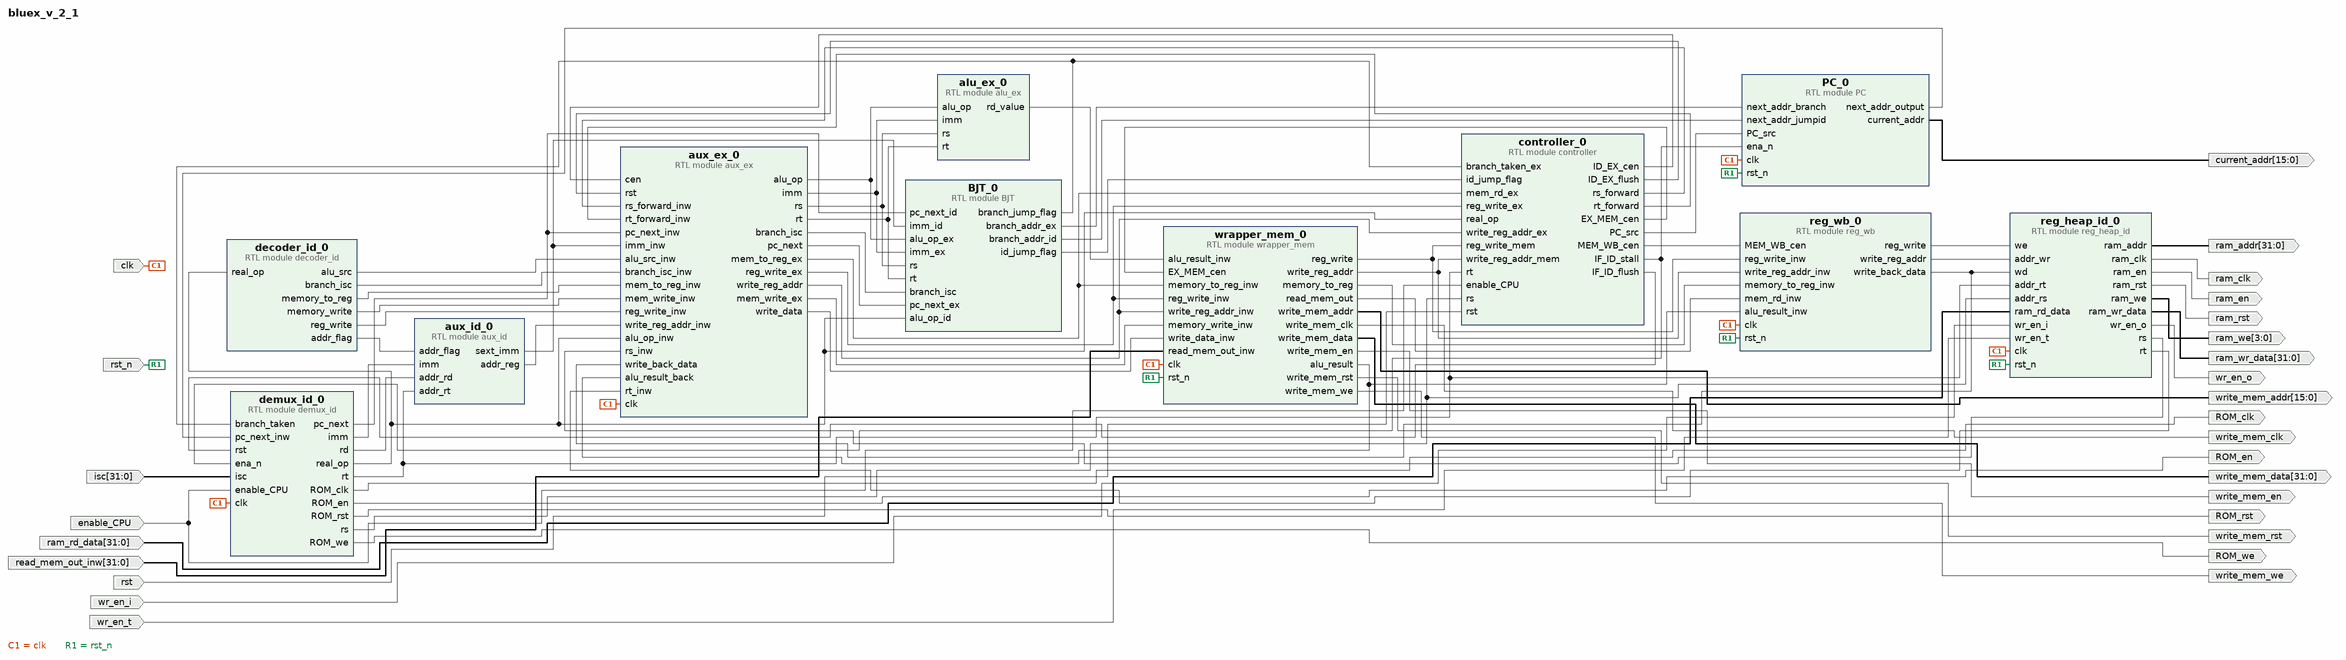
[diagram p0: block diagram of the top level]
# Vivado block design bluex_v_2_1, xc7z020clg400-2, Vivado 2023.2
create_bd_design bluex_v_2_1

create_bd_port -dir I -type clk clk
create_bd_port -dir I -type rst rst_n
create_bd_port -dir I enable_CPU
create_bd_port -dir I -type rst rst
set_property -dict {CONFIG.POLARITY ACTIVE_HIGH} [get_bd_ports rst]
create_bd_port -dir O -type clk write_mem_clk
create_bd_port -dir O -type rst write_mem_rst
create_bd_port -dir I -from 31 -to 0 read_mem_out_inw
create_bd_port -dir O -from 15 -to 0 write_mem_addr
create_bd_port -dir O write_mem_en
create_bd_port -dir O write_mem_we
create_bd_port -dir O -from 31 -to 0 write_mem_data
create_bd_port -dir I -from 31 -to 0 isc
create_bd_port -dir O -from 15 -to 0 current_addr
create_bd_port -dir O -from 3 -to 0 ram_we
create_bd_port -dir O ram_en
create_bd_port -dir O -from 31 -to 0 ram_addr
create_bd_port -dir O -type clk ram_clk
create_bd_port -dir O wr_en_o
create_bd_port -dir I -from 31 -to 0 ram_rd_data
create_bd_port -dir I wr_en_t
create_bd_port -dir I wr_en_i
create_bd_port -dir O -from 31 -to 0 ram_wr_data
create_bd_port -dir O -type rst ram_rst
create_bd_port -dir O ROM_en
create_bd_port -dir O ROM_we
create_bd_port -dir O -type clk ROM_clk
create_bd_port -dir O -type rst ROM_rst

create_bd_cell -type module -reference aux_ex aux_ex_0
create_bd_cell -type module -reference BJT BJT_0
create_bd_cell -type module -reference PC PC_0
create_bd_cell -type module -reference alu_ex alu_ex_0
create_bd_cell -type module -reference aux_id aux_id_0
create_bd_cell -type module -reference demux_id demux_id_0
create_bd_cell -type module -reference reg_heap_id reg_heap_id_0
create_bd_cell -type module -reference reg_wb reg_wb_0
create_bd_cell -type module -reference wrapper_mem wrapper_mem_0
create_bd_cell -type module -reference decoder_id decoder_id_0
create_bd_cell -type module -reference controller controller_0

# ---- connections ----

connect_bd_net -net BJT_0_branch_addr [get_bd_pins BJT_0/branch_addr_ex] [get_bd_pins PC_0/next_addr_branch]
connect_bd_net [get_bd_pins BJT_0/branch_addr_id] [get_bd_pins PC_0/next_addr_jumpid]
connect_bd_net [get_bd_pins BJT_0/branch_jump_flag] [get_bd_pins controller_0/branch_taken_ex] [get_bd_pins demux_id_0/branch_taken]
connect_bd_net [get_bd_pins BJT_0/id_jump_flag] [get_bd_pins controller_0/id_jump_flag]
connect_bd_net [get_bd_pins PC_0/current_addr] [get_bd_ports current_addr]
connect_bd_net [get_bd_pins PC_0/next_addr_output] [get_bd_pins demux_id_0/pc_next_inw]
connect_bd_net [get_bd_pins alu_ex_0/rd_value] [get_bd_pins wrapper_mem_0/alu_result_inw]
connect_bd_net [get_bd_pins aux_ex_0/alu_op] [get_bd_pins alu_ex_0/alu_op] [get_bd_pins BJT_0/alu_op_ex]
connect_bd_net [get_bd_pins aux_ex_0/branch_isc] [get_bd_pins BJT_0/branch_isc]
connect_bd_net [get_bd_pins aux_ex_0/imm] [get_bd_pins alu_ex_0/imm] [get_bd_pins BJT_0/imm_ex]
connect_bd_net [get_bd_pins aux_ex_0/mem_to_reg_ex] [get_bd_pins wrapper_mem_0/memory_to_reg_inw] [get_bd_pins controller_0/mem_rd_ex]
connect_bd_net [get_bd_pins aux_ex_0/mem_write_ex] [get_bd_pins wrapper_mem_0/memory_write_inw]
connect_bd_net [get_bd_pins aux_ex_0/pc_next] [get_bd_pins BJT_0/pc_next_ex]
connect_bd_net [get_bd_pins aux_ex_0/reg_write_ex] [get_bd_pins wrapper_mem_0/reg_write_inw] [get_bd_pins controller_0/reg_write_ex]
connect_bd_net [get_bd_pins aux_ex_0/rs] [get_bd_pins alu_ex_0/rs] [get_bd_pins BJT_0/rs]
connect_bd_net [get_bd_pins aux_ex_0/rt] [get_bd_pins alu_ex_0/rt] [get_bd_pins BJT_0/rt]
connect_bd_net [get_bd_pins aux_ex_0/write_data] [get_bd_pins wrapper_mem_0/write_data_inw]
connect_bd_net [get_bd_pins aux_ex_0/write_reg_addr] [get_bd_pins wrapper_mem_0/write_reg_addr_inw] [get_bd_pins controller_0/write_reg_addr_ex]
connect_bd_net [get_bd_pins aux_id_0/addr_reg] [get_bd_pins aux_ex_0/write_reg_addr_inw]
connect_bd_net [get_bd_pins aux_id_0/sext_imm] [get_bd_pins BJT_0/imm_id] [get_bd_pins aux_ex_0/imm_inw]
connect_bd_net -net clk_0_1 [get_bd_ports clk] \
  [get_bd_pins reg_wb_0/clk] [get_bd_pins wrapper_mem_0/clk] [get_bd_pins PC_0/clk] [get_bd_pins aux_ex_0/clk] \
  [get_bd_pins demux_id_0/clk] [get_bd_pins reg_heap_id_0/clk]
connect_bd_net [get_bd_pins controller_0/EX_MEM_cen] [get_bd_pins wrapper_mem_0/EX_MEM_cen]
connect_bd_net [get_bd_pins controller_0/ID_EX_cen] [get_bd_pins aux_ex_0/cen]
connect_bd_net [get_bd_pins controller_0/ID_EX_flush] [get_bd_pins aux_ex_0/rst]
connect_bd_net [get_bd_pins controller_0/IF_ID_flush] [get_bd_pins demux_id_0/rst]
connect_bd_net [get_bd_pins controller_0/IF_ID_stall] [get_bd_pins PC_0/ena_n] [get_bd_pins demux_id_0/ena_n]
connect_bd_net [get_bd_pins controller_0/MEM_WB_cen] [get_bd_pins reg_wb_0/MEM_WB_cen]
connect_bd_net [get_bd_pins controller_0/PC_src] [get_bd_pins PC_0/PC_src]
connect_bd_net [get_bd_pins controller_0/rs_forward] [get_bd_pins aux_ex_0/rs_forward_inw]
connect_bd_net [get_bd_pins controller_0/rt_forward] [get_bd_pins aux_ex_0/rt_forward_inw]
connect_bd_net [get_bd_pins decoder_id_0/addr_flag] [get_bd_pins aux_id_0/addr_flag]
connect_bd_net [get_bd_pins decoder_id_0/alu_src] [get_bd_pins aux_ex_0/alu_src_inw]
connect_bd_net -net decoder_id_0_branch [get_bd_pins decoder_id_0/branch_isc] [get_bd_pins aux_ex_0/branch_isc_inw]
connect_bd_net [get_bd_pins decoder_id_0/memory_to_reg] [get_bd_pins aux_ex_0/mem_to_reg_inw]
connect_bd_net [get_bd_pins decoder_id_0/memory_write] [get_bd_pins aux_ex_0/mem_write_inw]
connect_bd_net [get_bd_pins decoder_id_0/reg_write] [get_bd_pins aux_ex_0/reg_write_inw]
connect_bd_net [get_bd_pins demux_id_0/ROM_clk] [get_bd_ports ROM_clk]
connect_bd_net [get_bd_pins demux_id_0/ROM_en] [get_bd_ports ROM_en]
connect_bd_net [get_bd_pins demux_id_0/ROM_rst] [get_bd_ports ROM_rst]
connect_bd_net [get_bd_pins demux_id_0/ROM_we] [get_bd_ports ROM_we]
connect_bd_net [get_bd_pins demux_id_0/imm] [get_bd_pins aux_id_0/imm]
connect_bd_net [get_bd_pins demux_id_0/pc_next] [get_bd_pins BJT_0/pc_next_id] [get_bd_pins aux_ex_0/pc_next_inw]
connect_bd_net [get_bd_pins demux_id_0/rd] [get_bd_pins aux_id_0/addr_rd]
connect_bd_net [get_bd_pins demux_id_0/real_op] \
  [get_bd_pins decoder_id_0/real_op] [get_bd_pins controller_0/real_op] [get_bd_pins BJT_0/alu_op_id] \
  [get_bd_pins aux_ex_0/alu_op_inw]
connect_bd_net [get_bd_pins demux_id_0/rs] [get_bd_pins controller_0/rs] [get_bd_pins reg_heap_id_0/addr_rs]
connect_bd_net [get_bd_pins demux_id_0/rt] [get_bd_pins controller_0/rt] [get_bd_pins aux_id_0/addr_rt] [get_bd_pins reg_heap_id_0/addr_rt]
connect_bd_net -net enable_CPU_0_1 [get_bd_ports enable_CPU] [get_bd_pins controller_0/enable_CPU] [get_bd_pins demux_id_0/enable_CPU]
connect_bd_net -net isc_0_1 [get_bd_ports isc] [get_bd_pins demux_id_0/isc]
connect_bd_net -net ram_rd_data_0_1 [get_bd_ports ram_rd_data] [get_bd_pins reg_heap_id_0/ram_rd_data]
connect_bd_net -net read_mem_out_inw_0_1 [get_bd_ports read_mem_out_inw] [get_bd_pins wrapper_mem_0/read_mem_out_inw]
connect_bd_net [get_bd_pins reg_heap_id_0/ram_addr] [get_bd_ports ram_addr]
connect_bd_net [get_bd_pins reg_heap_id_0/ram_clk] [get_bd_ports ram_clk]
connect_bd_net [get_bd_pins reg_heap_id_0/ram_en] [get_bd_ports ram_en]
connect_bd_net [get_bd_pins reg_heap_id_0/ram_rst] [get_bd_ports ram_rst]
connect_bd_net [get_bd_pins reg_heap_id_0/ram_we] [get_bd_ports ram_we]
connect_bd_net [get_bd_pins reg_heap_id_0/ram_wr_data] [get_bd_ports ram_wr_data]
connect_bd_net [get_bd_pins reg_heap_id_0/rs] [get_bd_pins aux_ex_0/rs_inw]
connect_bd_net [get_bd_pins reg_heap_id_0/rt] [get_bd_pins aux_ex_0/rt_inw]
connect_bd_net [get_bd_pins reg_heap_id_0/wr_en_o] [get_bd_ports wr_en_o]
connect_bd_net [get_bd_pins reg_wb_0/reg_write] [get_bd_pins reg_heap_id_0/we]
connect_bd_net [get_bd_pins reg_wb_0/write_back_data] [get_bd_pins aux_ex_0/write_back_data] [get_bd_pins reg_heap_id_0/wd]
connect_bd_net [get_bd_pins reg_wb_0/write_reg_addr] [get_bd_pins reg_heap_id_0/addr_wr]
connect_bd_net -net rst_0_1 [get_bd_ports rst] [get_bd_pins controller_0/rst]
connect_bd_net -net rst_n_0_1 [get_bd_ports rst_n] \
  [get_bd_pins reg_wb_0/rst_n] [get_bd_pins wrapper_mem_0/rst_n] [get_bd_pins PC_0/rst_n] [get_bd_pins reg_heap_id_0/rst_n]
connect_bd_net -net wr_en_i_0_1 [get_bd_ports wr_en_i] [get_bd_pins reg_heap_id_0/wr_en_i]
connect_bd_net -net wr_en_t_0_1 [get_bd_ports wr_en_t] [get_bd_pins reg_heap_id_0/wr_en_t]
connect_bd_net [get_bd_pins wrapper_mem_0/alu_result] [get_bd_pins reg_wb_0/alu_result_inw] [get_bd_pins aux_ex_0/alu_result_back]
connect_bd_net [get_bd_pins wrapper_mem_0/memory_to_reg] [get_bd_pins reg_wb_0/memory_to_reg_inw]
connect_bd_net [get_bd_pins wrapper_mem_0/read_mem_out] [get_bd_pins reg_wb_0/mem_rd_inw]
connect_bd_net [get_bd_pins wrapper_mem_0/reg_write] [get_bd_pins reg_wb_0/reg_write_inw] [get_bd_pins controller_0/reg_write_mem]
connect_bd_net [get_bd_pins wrapper_mem_0/write_mem_addr] [get_bd_ports write_mem_addr]
connect_bd_net [get_bd_pins wrapper_mem_0/write_mem_clk] [get_bd_ports write_mem_clk]
connect_bd_net [get_bd_pins wrapper_mem_0/write_mem_data] [get_bd_ports write_mem_data]
connect_bd_net [get_bd_pins wrapper_mem_0/write_mem_en] [get_bd_ports write_mem_en]
connect_bd_net [get_bd_pins wrapper_mem_0/write_mem_rst] [get_bd_ports write_mem_rst]
connect_bd_net [get_bd_pins wrapper_mem_0/write_mem_we] [get_bd_ports write_mem_we]
connect_bd_net [get_bd_pins wrapper_mem_0/write_reg_addr] [get_bd_pins reg_wb_0/write_reg_addr_inw] [get_bd_pins controller_0/write_reg_addr_mem]

validate_bd_design
save_bd_design
